# EAGLE design PlantController (EAGLE 6.2)

## Sheet 1 of 3
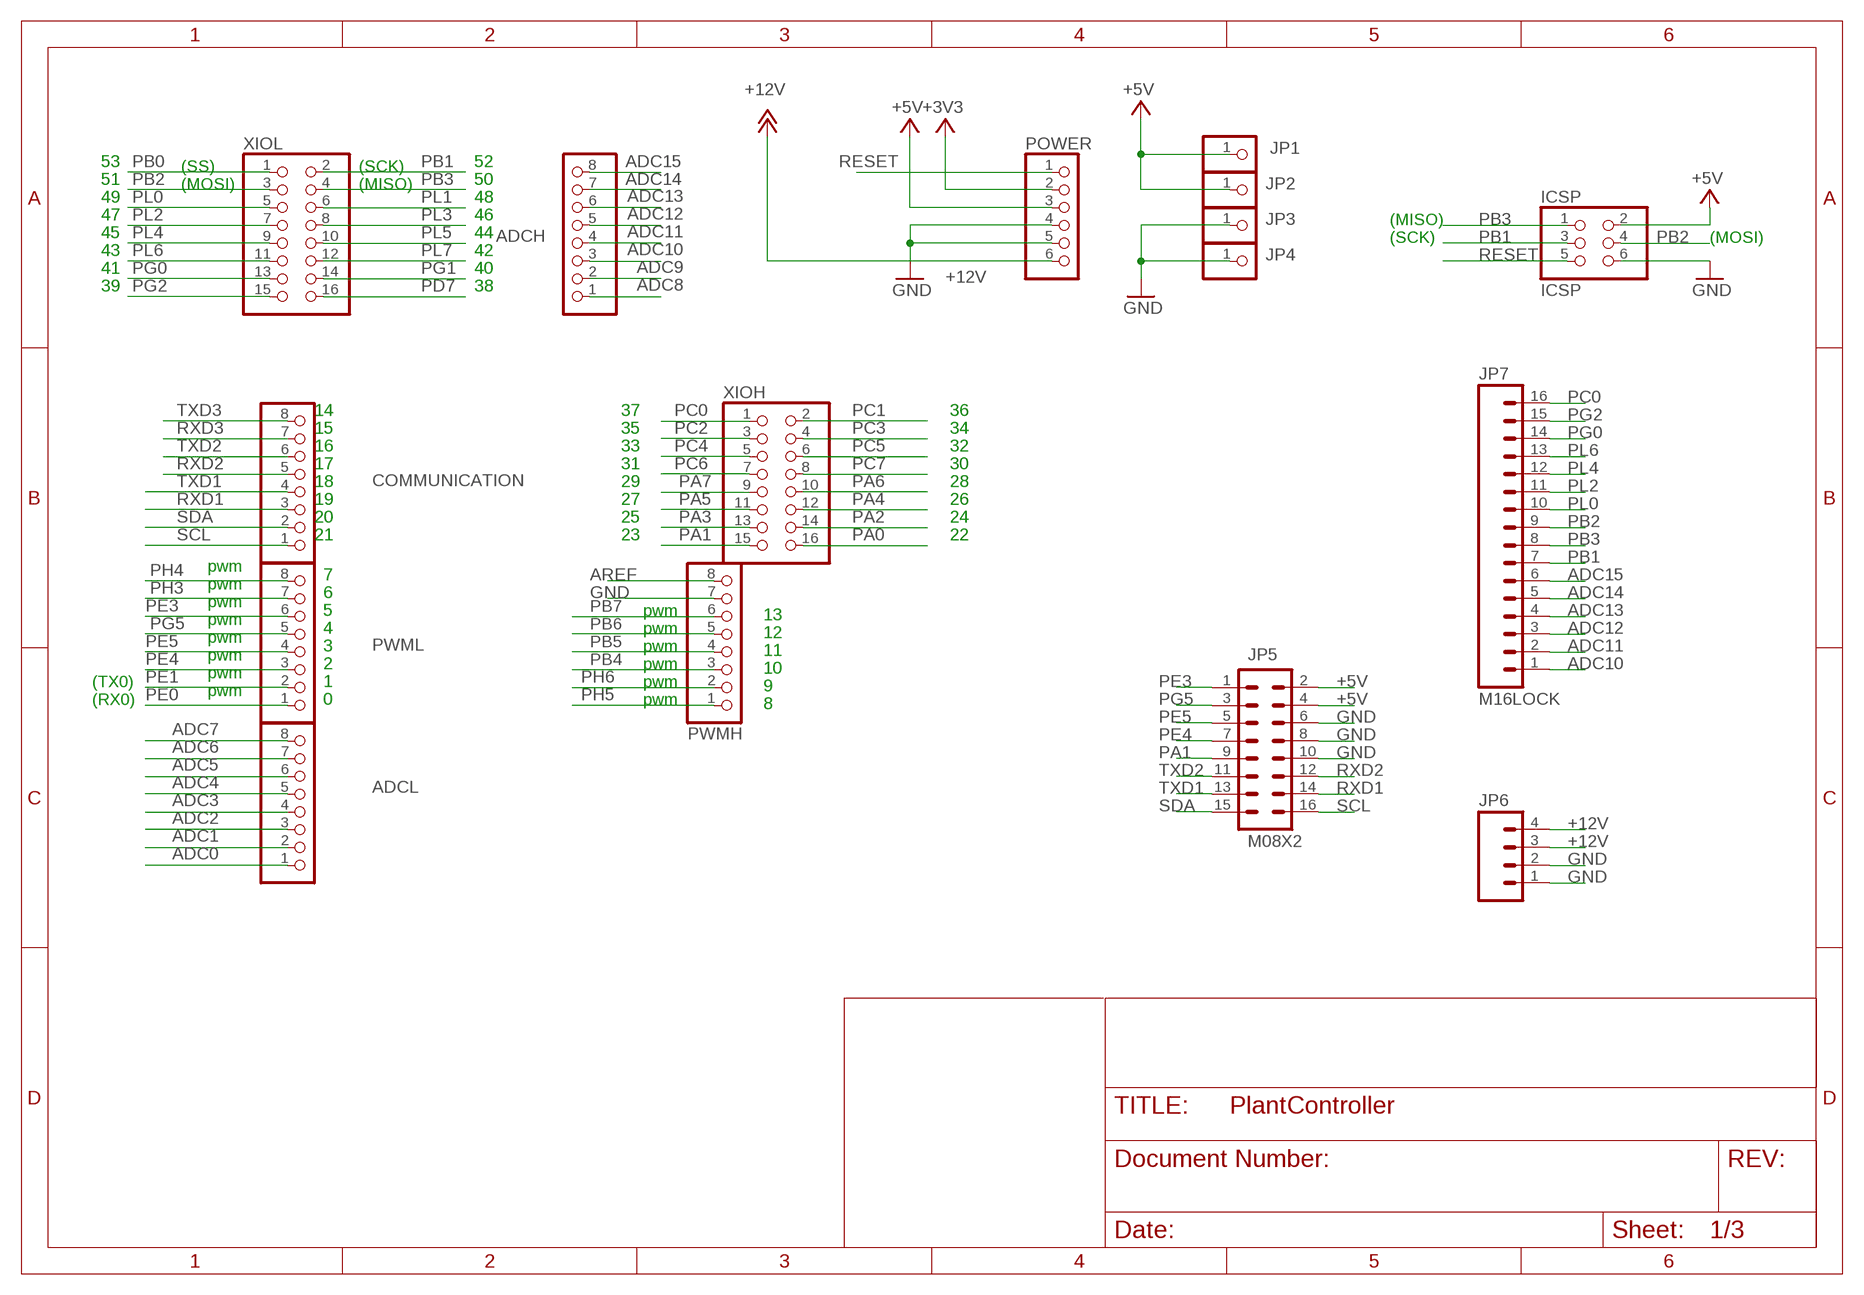
[diagram p0: schematic, sheet 1]

### Parts
ADCH  PINHD-1X8  [1X08]
ADCL  PINHD-1X8  [1X08]
COMMUNICATION  PINHD-1X8  [1X08]
ICSP  ICSP  PINHD-2X3  [2X03]
JP1  PINHD-1X1  [1X01]
JP2  PINHD-1X1  [1X01]
JP3  PINHD-1X1  [1X01]
JP4  PINHD-1X1  [1X01]
JP5  M08X2  [2X8]
JP6  M04LONGPADS  [1X04_LONGPADS]
JP7  M16LOCK  [1X16_LOCK]
POWER  PINHD-1X6  [1X06]
PWMH  PINHD-1X8  [1X08]
PWML  PINHD-1X8  [1X08]
XIOH  PINHD-2X8  [2X08]
XIOL  PINHD-2X8  [2X08]

### Nets
+3V3: POWER.2
+5V: ICSP.2 JP1.1 JP2.1 JP5.2 JP5.4 POWER.3
+12V: JP6.3 JP6.4 POWER.6 ; also sheet 2,3
ADC0: ADCL.1 ; also sheet 2
ADC1: ADCL.2 ; also sheet 2
ADC2: ADCL.3 ; also sheet 3
ADC3: ADCL.4 ; also sheet 3
ADC4: ADCL.5
ADC5: ADCL.6
ADC6: ADCL.7
ADC7: ADCL.8
ADC8: ADCH.1
ADC9: ADCH.2
ADC10: ADCH.3 JP7.1
ADC11: ADCH.4 JP7.2
ADC12: ADCH.5 JP7.3
ADC13: ADCH.6 JP7.4
ADC14: ADCH.7 JP7.5
ADC15: ADCH.8 JP7.6
AREF: PWMH.8
GND: ICSP.6 JP3.1 JP4.1 JP5.6 JP5.8 JP5.10 JP6.1 JP6.2 POWER.4 POWER.5 PWMH.7 ; also sheet 2,3
PA0: XIOH.16
PA1: JP5.9 XIOH.15
PA2: XIOH.14
PA3: XIOH.13
PA4: XIOH.12
PA5: XIOH.11
PA6: XIOH.10
PA7: XIOH.9
PB0: XIOL.1
PB1: ICSP.3 JP7.7 XIOL.2
PB2: ICSP.4 JP7.9 XIOL.3
PB3: ICSP.1 JP7.8 XIOL.4
PB4: PWMH.3
PB5: PWMH.4
PB6: PWMH.5
PB7: PWMH.6
PC0: JP7.16 XIOH.1
PC1: XIOH.2
PC2: XIOH.3
PC3: XIOH.4
PC4: XIOH.5
PC5: XIOH.6
PC6: XIOH.7
PC7: XIOH.8
PD7: XIOL.16
PE0: PWML.1
PE1: PWML.2
PE3: JP5.1 PWML.6
PE4: JP5.7 PWML.3
PE5: JP5.5 PWML.4
PG0: JP7.14 XIOL.13
PG1: XIOL.14
PG2: JP7.15 XIOL.15
PG5: JP5.3 PWML.5
PH3: PWML.7
PH4: PWML.8
PH5: PWMH.1
PH6: PWMH.2
PL0: JP7.10 XIOL.5
PL1: XIOL.6
PL2: JP7.11 XIOL.7
PL3: XIOL.8
PL4: JP7.12 XIOL.9
PL5: XIOL.10
PL6: JP7.13 XIOL.11
PL7: XIOL.12
RESET: ICSP.5 POWER.1
RXD1: COMMUNICATION.3 JP5.14
RXD2: COMMUNICATION.5 JP5.12
RXD3: COMMUNICATION.7
SCL: COMMUNICATION.1 JP5.16
SDA: COMMUNICATION.2 JP5.15
TXD1: COMMUNICATION.4 JP5.13
TXD2: COMMUNICATION.6 JP5.11
TXD3: COMMUNICATION.8

### Notes on the sheet
- 53 | (SS) | (SCK) | 52
- 51 | (MOSI) | (MISO) | 50
- 49 | 48
- 47 | 46 | (MISO)
- 45 | 44 | (SCK) | (MOSI)
- 43 | 42
- 41 | 40
- 39 | 38
- 14 | 37 | 36
- 15 | 35 | 34
- 16 | 33 | 32
- 17 | 31 | 30
- 18 | 29 | 28
- 19 | 27 | 26
- 20 | 25 | 24
- 21 | 23 | 22
- pwm
- 7
- pwm
- 6
- pwm
- 5 | pwm | 13
- pwm
- 4 | pwm | 12
- pwm
- 3 | pwm | 11
- pwm
- 2 | pwm | 10
- pwm
- (TX0) | 1 | pwm | 9
- pwm
- (RX0) | 0 | pwm | 8

## Sheet 2 of 3
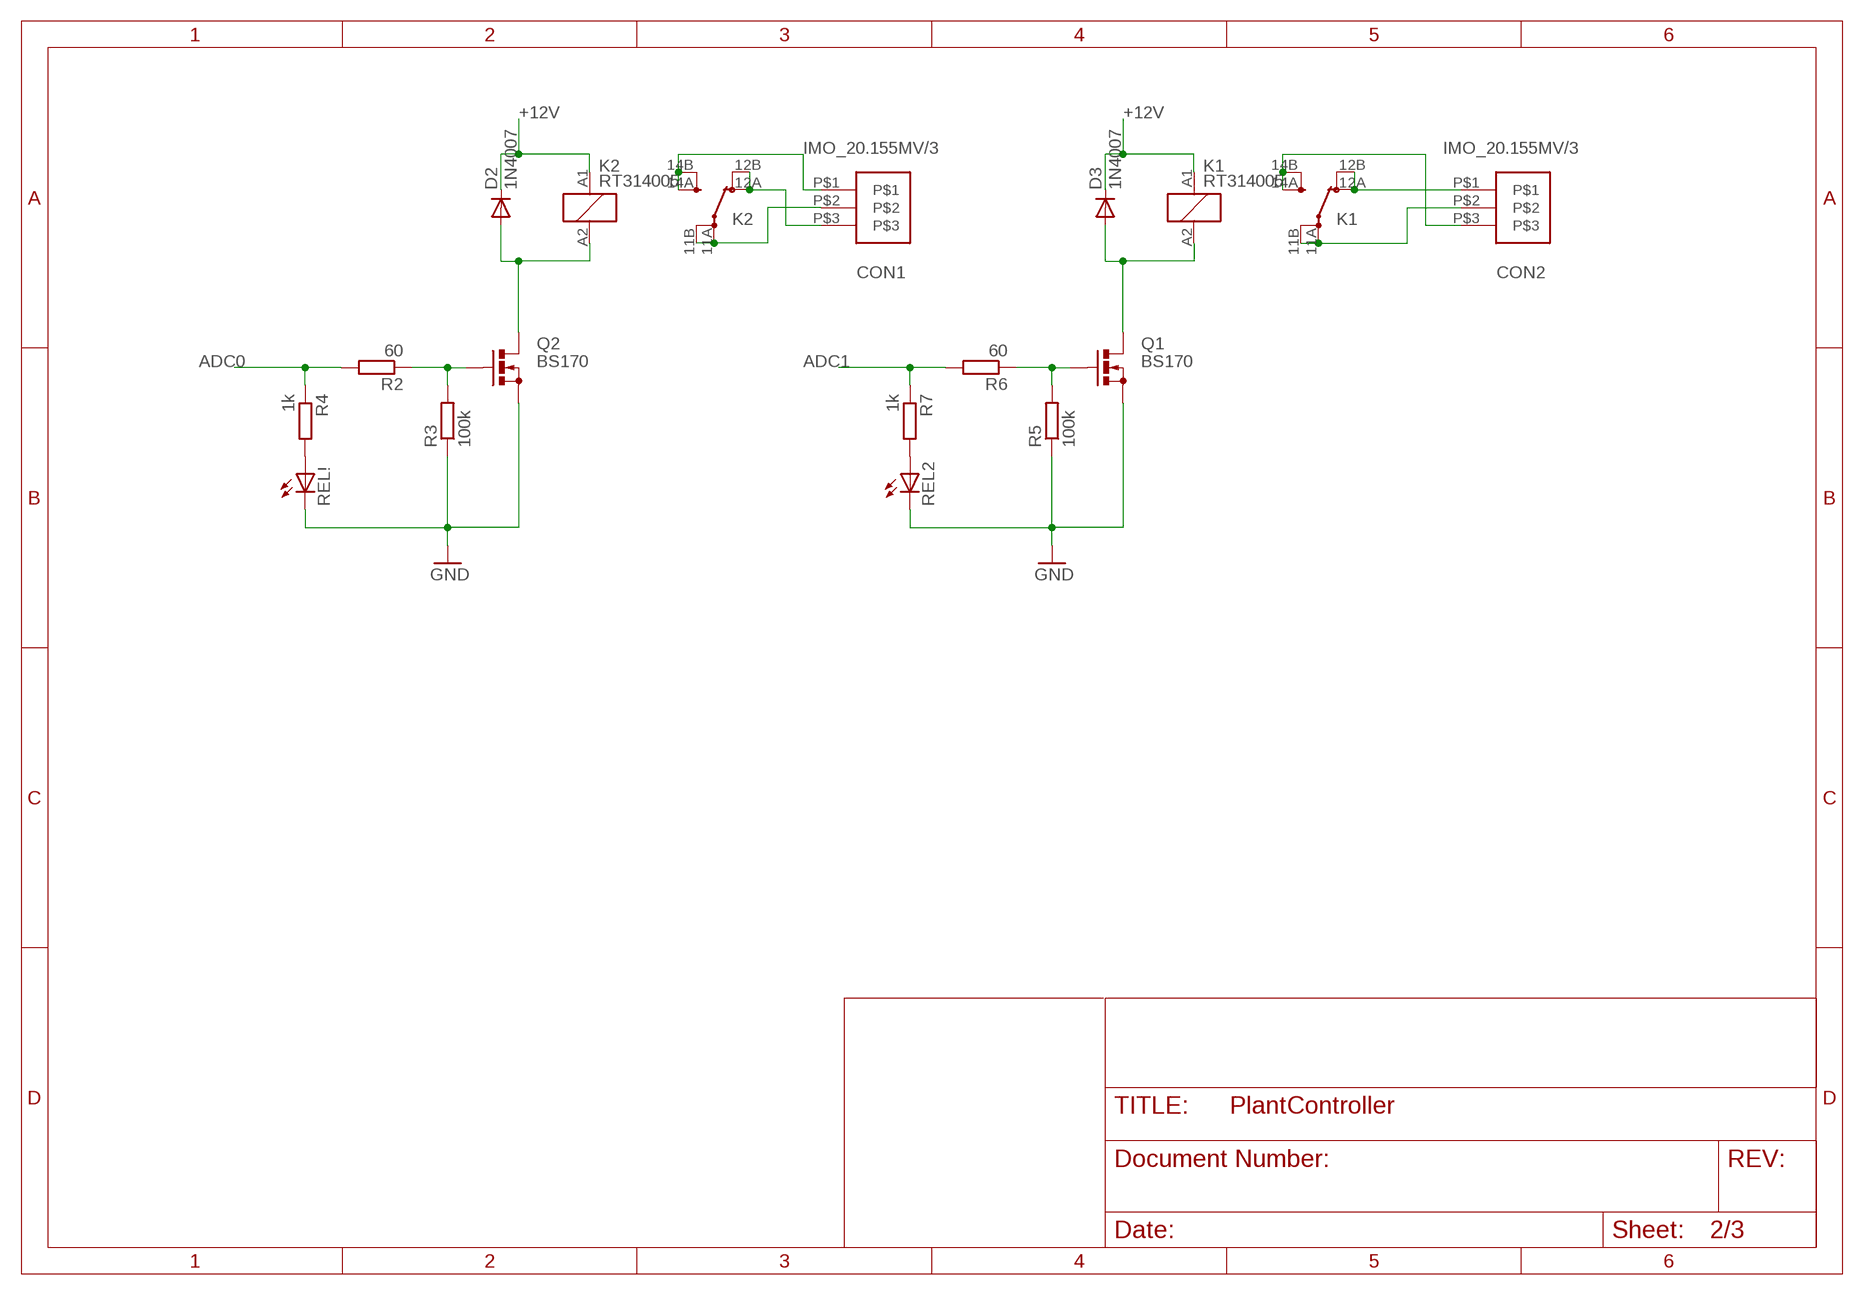
[diagram p1: schematic, sheet 2]

### Parts
CON1  IMO_20.155MV/3  [IMO_20.155MV/3]
CON2  IMO_20.155MV/3  [IMO_20.155MV/3]
D2  1N4007  1N4004  [DO41-10]
D3  1N4007  1N4004  [DO41-10]
K1  RT314005  [RT-C/O16A5]
K2  RT314005  [RT-C/O16A5]
Q1  BS170  [SOT54E]
Q2  BS170  [SOT54E]
R2  60  R-EU_R0805  [R0805]
R3  100k  R-EU_R0805  [R0805]
R4  1k  R-EU_R0805  [R0805]
R5  100k  R-EU_R0805  [R0805]
R6  60  R-EU_R0805  [R0805]
R7  1k  R-EU_R0805  [R0805]
REL2  LED5MM  [LED5MM]
REL!  LED5MM  [LED5MM]

### Nets
+12V: D2.C D3.C K1.A1 K2.A1 ; also sheet 1,3
ADC0: R2.2 R4.1 ; also sheet 1
ADC1: R6.2 R7.1 ; also sheet 1
GND: Q1.S Q2.S R3.1 R5.1 REL2.K(C) REL!.K(C) ; also sheet 1,3
N$3: D2.A K2.A2 Q2.D
N$4: Q2.G R2.1 R3.2
N$6: D3.A K1.A2 Q1.D
N$7: R4.2 REL!.A
N$8: Q1.G R5.2 R6.1
N$10: R7.2 REL2.A
N$11: CON1.P$2 K2.11A(2:PA) K2.11B(2:PB)
N$12: CON1.P$3 K2.12A(2:OA) K2.12B(2:OB)
N$13: CON1.P$1 K2.14A(2:SA) K2.14B(2:SB)
N$14: CON2.P$2 K1.11A(2:PA) K1.11B(2:PB)
N$15: CON2.P$1 K1.12A(2:OA) K1.12B(2:OB)
N$16: CON2.P$3 K1.14A(2:SA) K1.14B(2:SB)

## Sheet 3 of 3
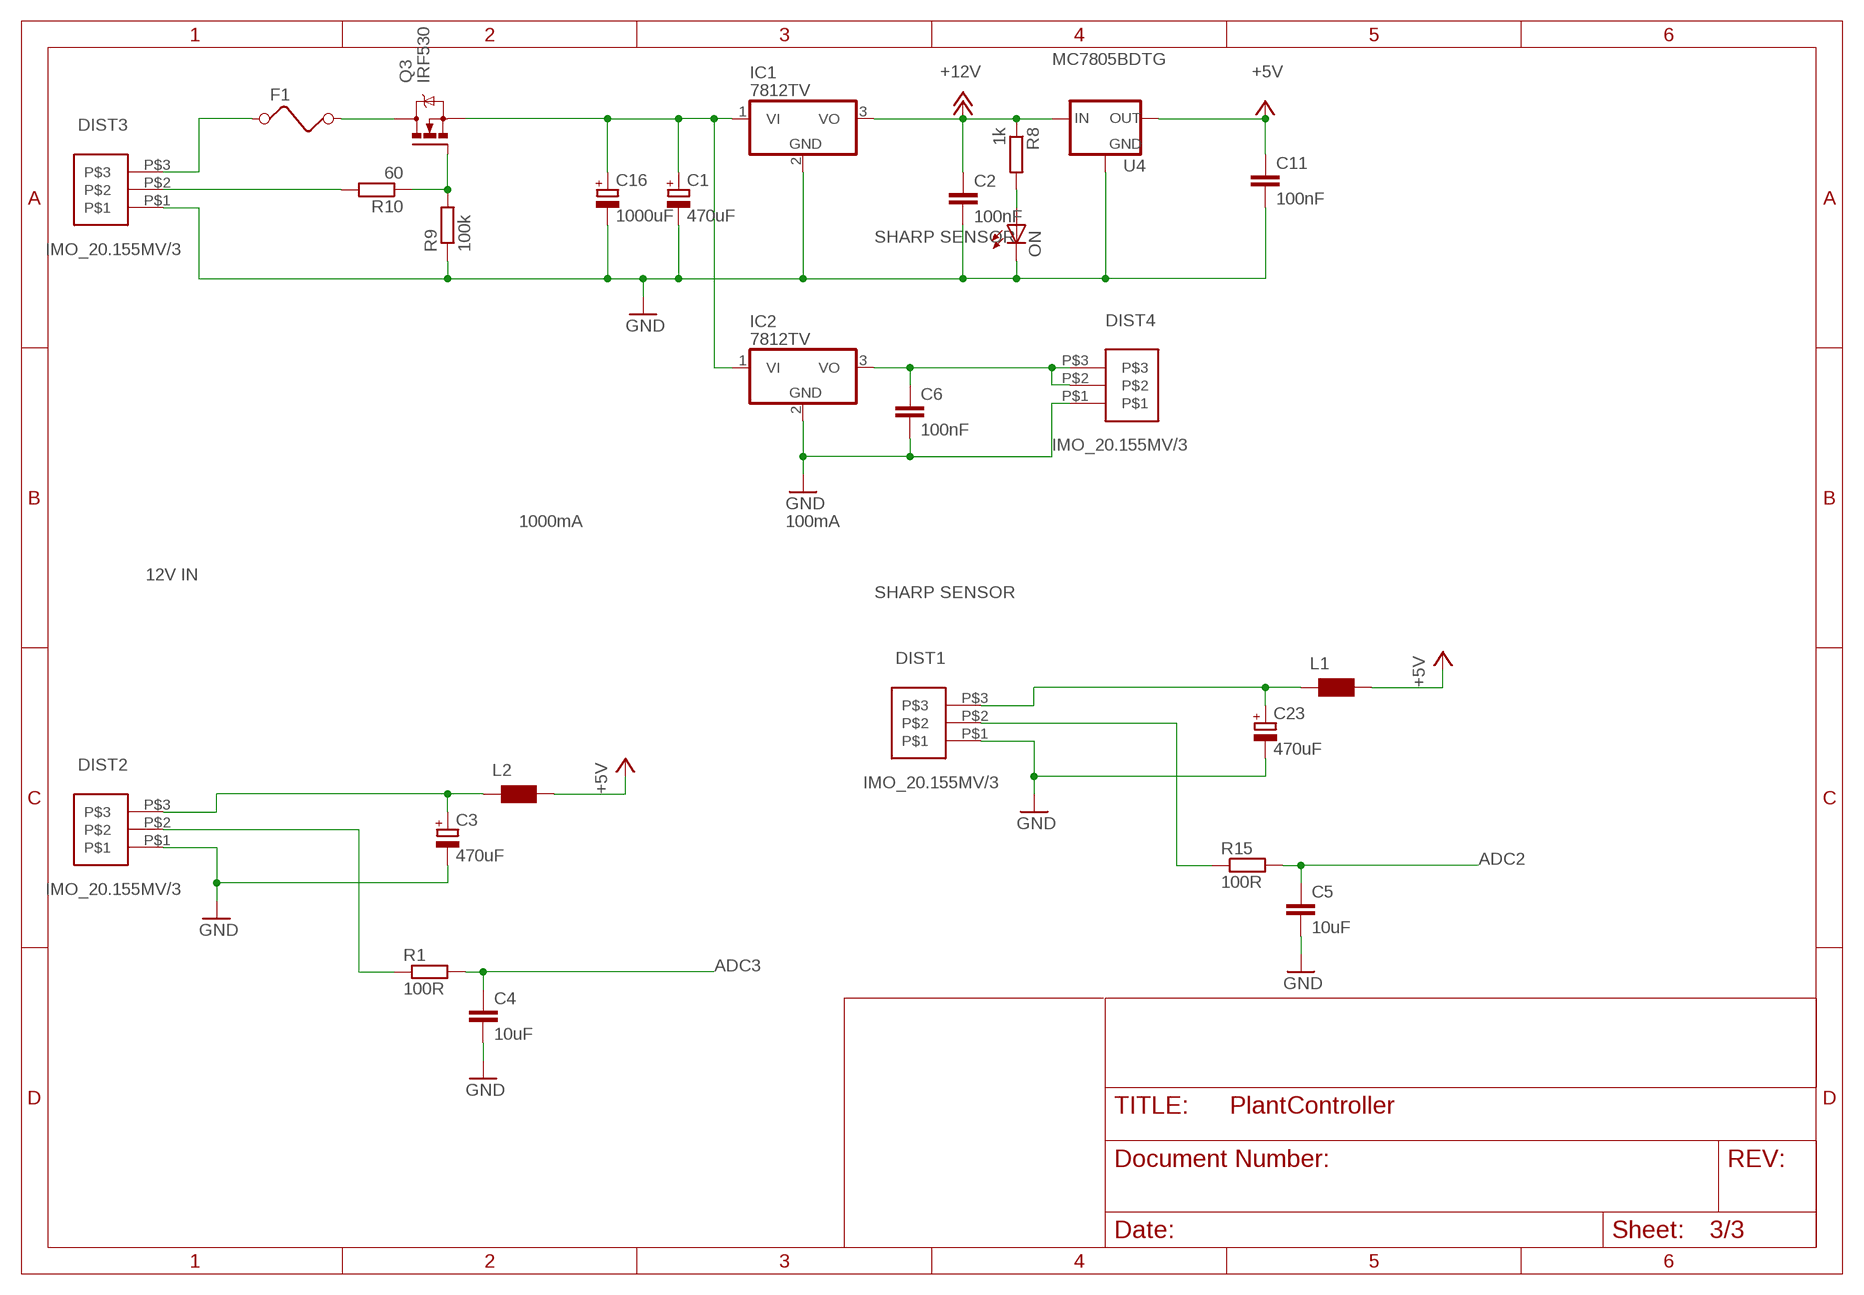
[diagram p2: schematic, sheet 3]

### Parts
C1  470uF  CPOL-EUE7.5-16  [E7,5-16]
C2  100nF  C-EUC0805K  [C0805K]
C3  470uF  CPOL-EUF  [PANASONIC_F]
C4  10uF  C-EUC0805K  [C0805K]
C5  10uF  C-EUC0805K  [C0805K]
C6  100nF  C-EUC0805K  [C0805K]
C11  100nF  C-EUC0805K  [C0805K]
C16  1000uF  CPOL-EUE7.5-16  [E7,5-16]
C23  470uF  CPOL-EUF  [PANASONIC_F]
DIST1  IMO_20.155MV/3  [IMO_20.155MV/3]
DIST2  IMO_20.155MV/3  [IMO_20.155MV/3]
DIST3  IMO_20.155MV/3  [IMO_20.155MV/3]
DIST4  IMO_20.155MV/3  [IMO_20.155MV/3]
F1  FUSE  [FUSE]
IC1  7812TV  [TO220V]
IC2  7812TV  [TO220V]
L1  WE-KI_0805_B  [WE-KI_0805_B]
L2  WE-KI_0805_B  [WE-KI_0805_B]
ON  LED5MM  [LED5MM]
Q3  IRF530  [TO220BV]
R1  100R  R-EU_R0805  [R0805@1]
R8  1k  R-EU_R0805  [R0805]
R9  100k  R-EU_R0805  [R0805]
R10  60  R-EU_R0805  [R0805]
R15  100R  R-EU_R0805  [R0805@1]
U4  MC7805BDTG  [DPAK]

### Nets
+5V_SENS: C11.1 L1.1 L2.1 U4.3(OUT) ; supply symbol labelled +5V
+12V: C2.1 IC1.3(VO) R8.1 U4.1(IN) ; also sheet 1,2
ADC2: C5.1 R15.2 ; also sheet 1
ADC3: C4.1 R1.2 ; also sheet 1
GND: C1.- C2.2 C3.- C4.2 C5.2 C6.2 C11.2 C16.- C23.- DIST1.P$1 DIST2.P$1 DIST3.P$1 DIST4.P$1 IC1.2(GND) IC2.2(GND) ON.K(C) R9.1 U4.4(GND) ; also sheet 1,2
N$1: C6.1 DIST4.P$2 DIST4.P$3 IC2.3(VO)
N$22: Q3.G R9.2 R10.1
N$23: DIST3.P$2 R10.2
N$25: ON.A R8.2
SENSOR_POWER: C23.+ DIST1.P$3 L1.2
SENSOR_POWER1: C3.+ DIST2.P$3 L2.2
SHARP_SENSOR: DIST1.P$2 R15.1
SHARP_SENSOR1: DIST2.P$2 R1.1
VIN24: C1.+ C16.+ IC1.1(VI) IC2.1(VI) Q3.S
VINFIN: DIST3.P$3 F1.1
VINFOUT: F1.2 Q3.D

### Notes on the sheet
- SHARP SENSOR
- 1000mA | 100mA
- 12V IN
- SHARP SENSOR

## Library data of the parts
ADCH ADCL COMMUNICATION PWMH PWML = pinhead:PINHD-1X8: PIN HEADER
C1 C16 = rcl:CPOL-EU: POLARIZED CAPACITOR, European symbol
C2 C4-C6 C11 = resistor:C-EU: CAPACITOR, European symbol
C3 C23 = resistor:CPOL-EU: POLARIZED CAPACITOR, European symbol
CON1 CON2 DIST1-DIST4 = CONNECTORS:IMO_20.155MV/3
D2 D3 = diode:1N4004: DIODE general purpose rectifier, 1 A
F1 = special:FUSE: FUSE 5 x 20 mm
IC1 IC2 = linear:78*: Positive VOLTAGE REGULATOR Source: http://cache.national.com/ds/LM/LM78L05.pdf http://www.fairchildsemi.com/ds/LM/LM7805.pdf
ICSP = pinhead:PINHD-2X3: PIN HEADER
JP1-JP4 = pinhead:PINHD-1X1: PIN HEADER
JP5 = SparkFun:M08X2
JP6 = SparkFun:M04: Header 4 Standard 4-pin 0.1" header. Use with straight break away headers (SKU : PRT-00116), right angle break away headers (PRT-00553), swiss pins (PRT-00743), machine pins (PRT-00117), and female headers (PRT-00115). Molex polarized connector foot print use with SKU : PRT-08231 with associated crimp pins and housings. 1MM SMD Version SKU: PRT-10208
JP7 = SparkFun:M16
K1 K2 = relay:RT31*: Power PCB Relayl SCHRACK 1 pole 12 / 16 A, DC- or AC-coi Source: http://www.schrack.com/.. 5819.pdf; MPN: RT314005; OC_FARNELL: 1629043; OC_NEWARK: 03P2418
L1 L2 = wuerth-elektronik:WE-KI: SMD Wire Wound Ceramic Inductor WE-KI - Wire wound - High thermal stability - Rated current up to 1 A - High Q-factor - High SRF -- Especially developed for high frequency applications -- Perfect for applications in telecommunications -- Bluetooth -- Wireless LAN
ON REL2 REL! = led:LED: LED OSRAM: - CHIPLED LG R971, LG N971, LY N971, LG Q971, LY Q971, LO R971, LY R971 LH N974, LH R974 LS Q976, LO Q976, LY Q976 LO Q996 - Hyper CHIPLED LW Q18S LB Q993, LB Q99A, LB R99A - SideLED LS A670, LO A670, LY A670, LG A670, LP A670 LB A673, LV A673, LT A673, LW A673 LH A674 LY A675 LS A676, LA A676, LO A676, LY A676, LW A676 LS A679, LY A679, LG A679 - Hyper Micro SIDELED® LS Y876, LA Y876, LO Y876, LY Y876 LT Y87S - SmartLED LW L88C, LW L88S LB L89C, LB L89S, LG L890 LS L89K, LO L89K, LY L89K LS L896, LA L896, LO L896, LY L896 - TOPLED LS T670, LO T670, LY T670, LG T670, LP T670 LSG T670, LSP T670, LSY T670, LOP T670, LYG T670 LG T671, LOG T671, LSG T671 LB T673, LV T673, LT T673, LW T673 LH T674 LS T676, LA T676, LO T676, LY T676, LB T676, LH T676, LSB T676, LW T676 LB T67C, LV T67C, LT T67C, LS T67K, LO T67K, LY T67K, LW E67C LS E67B, LA E67B, LO E67B, LY E67B, LB E67C, LV E67C, LT E67C LW T67C LS T679, LY T679, LG T679 LS T770, LO T770, LY T770, LG T770, LP T770 LB T773, LV T773, LT T773, LW T773 LH T774 LS E675, LA E675, LY E675, LS T675 LS T776, LA T776, LO T776, LY T776, LB T776 LHGB T686 LT T68C, LB T68C - Hyper Mini TOPLED® LB M676 - Mini TOPLED Santana® LG M470 LS M47K, LO M47K, LY M47K Source: http://www.osram.convergy.de LUXEON: - LUMILED® LXK2-PW12-R00, LXK2-PW12-S00, LXK2-PW14-U00, LXK2-PW14-V00 LXK2-PM12-R00, LXK2-PM12-S00, LXK2-PM14-U00 LXK2-PE12-Q00, LXK2-PE12-R00, LXK2-PE12-S00, LXK2-PE14-T00, LXK2-PE14-U00 LXK2-PB12-K00, LXK2-PB12-L00, LXK2-PB12-M00, LXK2-PB14-N00, LXK2-PB14-P00, LXK2-PB14-Q00 LXK2-PR12-L00, LXK2-PR12-M00, LXK2-PR14-Q00, LXK2-PR14-R00 LXK2-PD12-Q00, LXK2-PD12-R00, LXK2-PD12-S00 LXK2-PH12-R00, LXK2-PH12-S00 LXK2-PL12-P00, LXK2-PL12-Q00, LXK2-PL12-R00 Source: www.luxeon.com KINGBRIGHT: KA-3528ASYC Source: www.kingbright.com
POWER = pinhead:PINHD-1X6: PIN HEADER
Q1 Q2 = transistor-small-signal:BS170: N-CHANNEL MOS FET
Q3 = transistor-power:IRF530: HEXFET Power MOSFET
R1 R15 = resistor:R-EU_: RESISTOR, European symbol
R2-R10 = rcl:R-EU_: RESISTOR, European symbol
U4 = VOLTAGE_REGULATORS:MC7805BDTG
XIOH XIOL = pinhead:PINHD-2X8: PIN HEADER

## Board
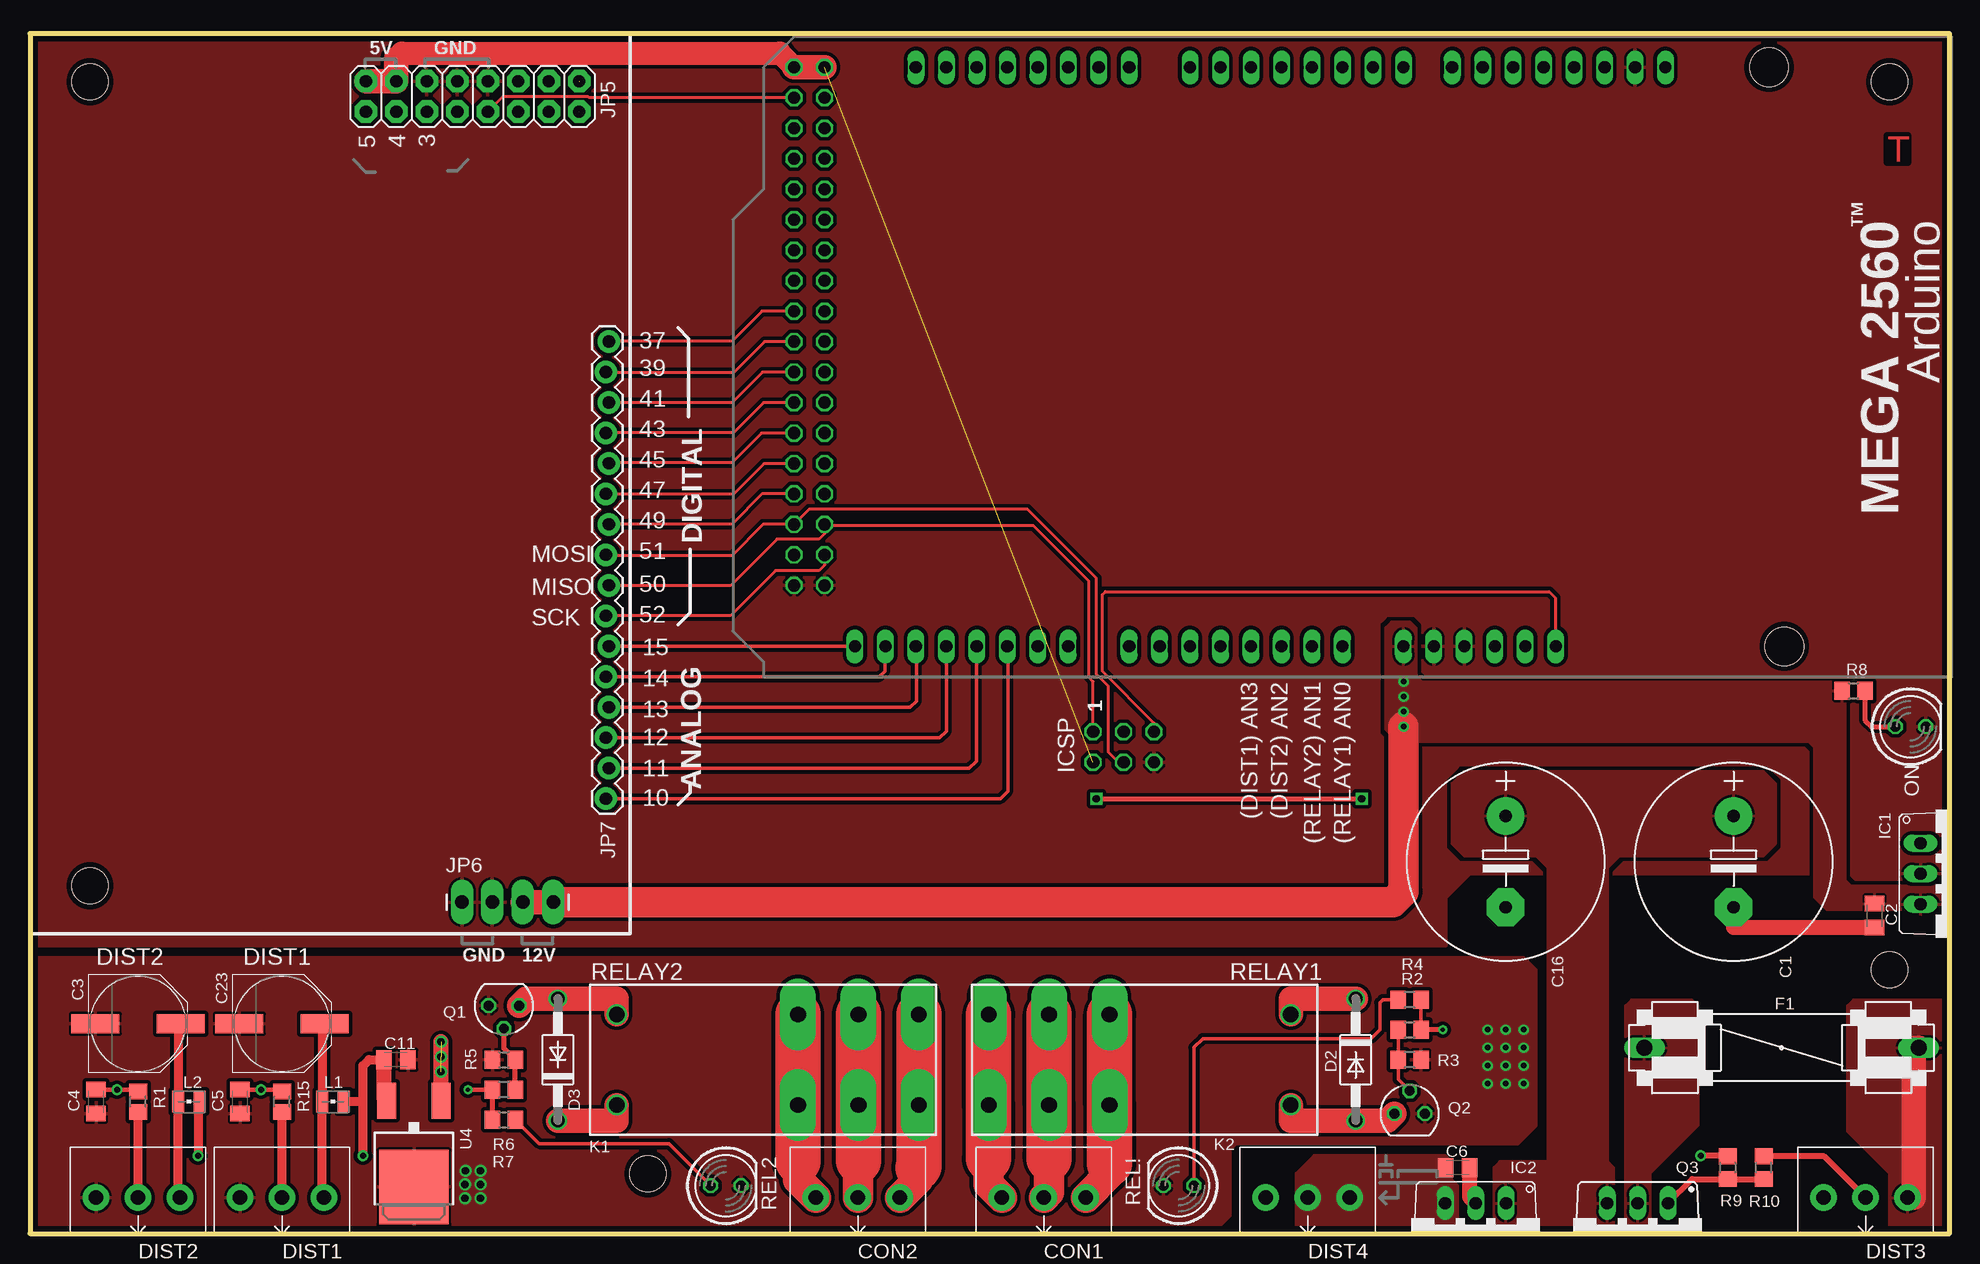
[diagram p3: board, top side]
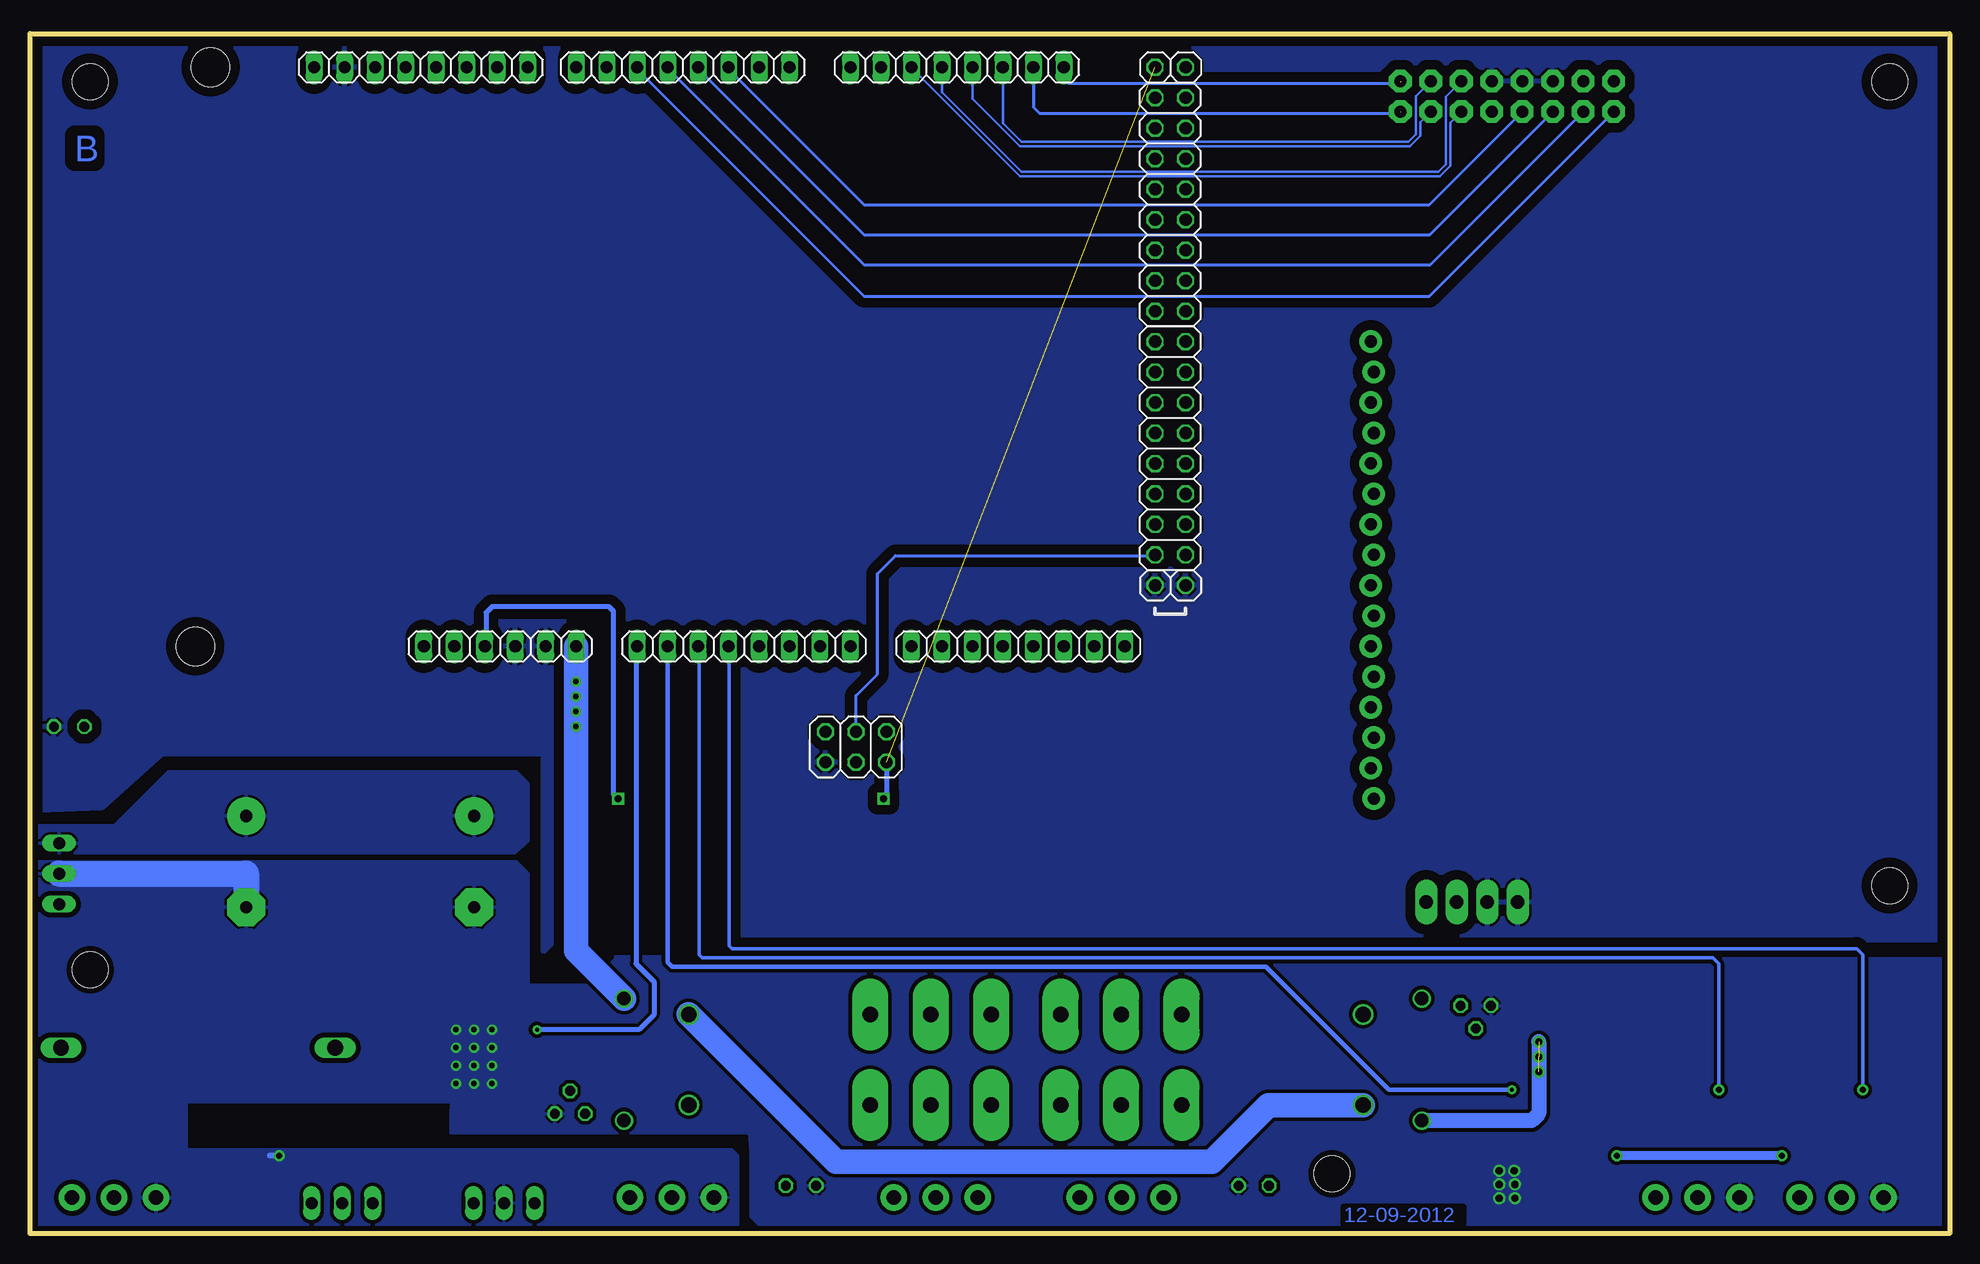
[diagram p4: board, bottom side, seen from below]

Size 160 x 100 mm. Coordinates in mm from the lower left corner, seen from the top.
Outline: 0,0 160,0 160,100 0,100 0,0
Copper layers (1*16): Top 0.018mm / dielectric 1.55mm / Bottom 0.018mm
Design rules: minimum track width 0.15mm, minimum drill 0.25mm, track to track 0.15mm, track to pad 0.15mm, pad to pad 0.15mm, via to via 0.15mm, smd to smd 0.15mm, copper to edge 0.45mm, drill to drill 0.3mm, minimum pad ring 0.2mm, minimum via ring 0.2mm, stop-mask expansion 0.1mm, vias tented up to drill 0mil, thermal gap 0.2mm
Holes 3.2 mm at 144.96,97.2 146.23,48.94
Holes 3 mm at 5,96 155,96 155,22 51.5,5 5,29

### Footprints (pad centres in the part's own frame; a part is rotated, then mirrored left to right if it is on the bottom)
1X08 = drill 1.016 long: 1 -8.89,0; 2 -6.35,0; 3 -3.81,0; 4 -1.27,0; 5 1.27,0; 6 3.81,0; 7 6.35,0; 8 8.89,0
E7,5-16 = drill 1.016 pad 3.15: + -3.81,0 | drill 1.016 pad 3.15 octagon: - 3.81,0
C0805K = smd 1.3 x 1.6: 1 -1,0; 2 1,0
PANASONIC_F = smd 4 x 1.6: + 3.55,0; - -3.55,0
IMO_20.155MV/3 = drill 1.2 pad 2.2: P$1 -3.5,0; P$2 0,0; P$3 3.5,0
DO41-10 = drill 1.118: A 5.08,0; C -5.08,0
FUSE = drill 1.321 long: 1 -11.43,0; 2 11.43,0
TO220V = drill 1.016 long: 1 -2.54,-2.54; 2 0,-2.54; 3 2.54,-2.54
2X03 = drill 1.016 octagon: 1 -2.54,-1.27; 2 -2.54,1.27; 3 0,-1.27; 4 0,1.27; 5 2.54,-1.27; 6 2.54,1.27
1X01 = drill 1.016 octagon: 1 0,0
2X8 = drill 1.016 pad 1.88 octagon: 1 0,0; 2 0,2.54; 3 2.54,0; 4 2.54,2.54; 5 5.08,0; 6 5.08,2.54; 7 7.62,0; 8 7.62,2.54; 9 10.16,0; 10 10.16,2.54; 11 12.7,0; 12 12.7,2.54; 13 15.24,0; 14 15.24,2.54; 15 17.78,0; 16 17.78,2.54
1X04_LONGPADS = drill 1.118 pad 1.88 long: 1 0,0; 2 2.54,0; 3 5.08,0; 4 7.62,0
1X16_LOCK = drill 1.016 pad 1.88: 1 0,0.127; 2 2.54,-0.127; 3 5.08,0.127; 4 7.62,-0.127; 5 10.16,0.127; 6 12.7,-0.127; 7 15.24,0.127; 8 17.78,-0.127; 9 20.32,0.127; 10 22.86,-0.127; 11 25.4,0.127; 12 27.94,-0.127; 13 30.48,0.127; 14 33.02,-0.127; 15 35.56,0.127; 16 38.1,-0.127
RT-C/O16A5 = drill 1.3 pad 3 long: 11A 7.56,3.78; 11B 7.56,-3.78; 12A 2.52,3.78; 12B 2.52,-3.78; 14A 12.6,3.78; 14B 12.6,-3.78 | drill 1.3: A1 -12.6,-3.78; A2 -12.6,3.78
WE-KI_0805_B = smd 1.02 x 1.78: 1 -0.89,0; 2 0.89,0
LED5MM = drill 0.813 octagon: A -1.27,0; K 1.27,0
1X06 = drill 1.016 long: 1 -6.35,0; 2 -3.81,0; 3 -1.27,0; 4 1.27,0; 5 3.81,0; 6 6.35,0
SOT54E = drill 0.813 octagon: D -1.27,0; G 0,1.905; S 1.27,0
TO220BV = drill 1.016 long: D 0,-2.54; G -2.54,-2.54; S 2.54,-2.54
R0805 = smd 1.3 x 1.5: 1 -0.85,0; 2 0.85,0
R0805' = smd 1.3 x 1.5: 1 -0.95,0; 2 0.95,0
DPAK = smd 1.6 x 3: 1 -2.28,-6.07; 3 2.28,-6.07 | smd 5.8 x 6.2: 4 0,1.11
2X08 = drill 1.016 octagon: 1 -8.89,-1.27; 2 -8.89,1.27; 3 -6.35,-1.27; 4 -6.35,1.27; 5 -3.81,-1.27; 6 -3.81,1.27; 7 -1.27,-1.27; 8 -1.27,1.27; 9 1.27,-1.27; 10 1.27,1.27; 11 3.81,-1.27; 12 3.81,1.27; 13 6.35,-1.27; 14 6.35,1.27; 15 8.89,-1.27; 16 8.89,1.27

### Placement (x,y rotation side)
ADCH  77.65,48.94 0 bottom
ADCL  100.51,48.94 0 bottom
C1  142,31 270 top
C2  153.75,26.5 270 top
C3  9,17.5 0 top
C4  5.5,11 270 top
C5  17.5,11 270 top
C6  119,5.5 0 top
C11  30.5,14.5 0 top
C16  123,31 270 top
C23  21,17.5 0 top
COMMUNICATION  82.73,97.2 180 bottom
CON1  84.5,3 0 top
CON2  69,3 0 top
D2  110.5,14.5 270 top
D3  44,14.5 90 top
DIST1  21,3 0 top
DIST2  9,3 0 top
DIST3  153,3 0 top
DIST4  106.5,3 0 top
F1  146,15.5 180 top
IC1  160.12,30 270 top
IC2  120.5,0 180 top
ICSP  91.16,40.55 180 bottom
JP1  66.22,97.2 0 bottom
JP2  63.68,97.2 0 bottom
JP3  66.22,54.02 0 bottom
JP4  63.68,54.02 0 bottom
JP5  28,93.5 0 top
JP6  36,27.62 0 top
JP7  48.12,36.25 90 top
K1  61.5,14.5 0 top
K2  92.5,14.5 180 top
L1  25.25,11 180 top
L2  13.25,11 180 top
ON  156.75,42.25 0 top
POWER  120.83,48.94 0 bottom
PWMH  127.43,97.2 180 bottom
PWML  105.59,97.2 180 bottom
Q1  39.5,19 180 top
Q2  115,10 0 top
Q3  134,0 180 top
R1  100R  [R0805]  9,11 90 top
R2  60  [R0805']  115,17 0 top
R3  100k  [R0805']  115,14.5 180 top
R4  1k  [R0805']  115,19.5 180 top
R5  100k  [R0805']  39.5,14.5 0 top
R6  60  [R0805']  39.5,12 180 top
R7  1k  [R0805']  39.5,9.5 0 top
R8  1k  [R0805']  152,45.25 0 top
R9  100k  [R0805']  141.5,5.5 270 top
R10  60  [R0805']  144.5,5.5 90 top
R15  100R  [R0805]  21,11 90 top
REL2  58,4 0 top
REL!  95.75,4 180 top
U4  32,5 180 top
XIOH  64.95,85.77 90 bottom
XIOL  64.95,65.45 90 bottom

### Tracks (layer width: path | path; a pad name or v marks a point on that pad's centre or on a via)
+5V  (via drill 0.6 pad 0.61)  (1 unrouted)
  Top 0: JP5.2 28.21,96.04
  Top 0.406: v88.88,36.25 v111,36.25
  Top 1.778: 30.54,97.92 31,98.38 | 62.51,98.38 JP2.1
  Top 1.93: 31,98.38 62.51,98.38
  Top 2.032: JP5.2 JP5.4 30.54,97.92 | JP2.1 JP1.1
  Bottom 0.406: ICSP.2 88.62,36.51 v88.88,36.25 | v111,36.25 111.38,36.62 111.38,51.88 111.75,52.25 121.5,52.25 122,51.75 122,49.04 POWER.3
+5V_SENS  (via drill 0.5)
  Top 0.762: 27.75,11 L1.1 | L2.1 14,10.86 v14,6.5 | v27.75,6.5 27.75,11 | 27.75,11 27.75,14 28.25,14.5 C11.1
  Top 1.27: U4.3 29.5,11.29 C11.1
  Bottom 0.762: v14,6.5 v27.75,6.5
+12V  (via drill 0.45, 0.6)  (2 unrouted)
  Top 1.27: U4.1 34.25,11.1 v34.25,16
  Top 1.422: 114.48,42.23 v114.5,42.25
  Top 2.032: D2.C 105.1,19.58 K2.A1 | D3.C 48.9,9.42 K1.A1 | JP6.4 JP6.3
  Top 2.54: 114.48,42.23 114.48,28.5 113.61,27.62 JP6.4
  Bottom 1.27: v34.25,16 34.25,10 34.83,9.42 D3.C
  Bottom 2.032: K2.A1 92.82,6 61.5,6 56.78,10.72 K1.A1 | D2.C 114.48,23.56 POWER.6
  other vias: 114.5,46 114.5,44.75 114.5,43.5 34.25,14.75 34.25,13.5
  pour Top (isolate 0.305): 161.5,26.5 158,26.5 156,27 149.75,27 148.75,28 148.75,40.5 148.25,41 114,41 113,42 113,50.5 113.5,51 115,51 115.5,50.5 115.5,46.5 116,46 150.25,46 151.25,45 151.25,29.5 151.75,29 161,29 161.5,28.5
ADC0  (via drill 0.35)
  Top 0.305: R2.2 R4.1
  Top 0.406: v117.75,17 R2.2
  Bottom 0.406: ADCL.1 109.5,48.84 109.5,22.5 108,21 108,18.25 109.25,17 v117.75,17
ADC1  (via drill 0.35)
  Top 0.381: R6.2 v36.5,12
  Top 0.406: R7.1 R6.2
  Bottom 0.381: v36.5,12 46.75,12 57,22.25 106.5,22.25 106.86,22.61 ADCL.2
ADC2  (via drill 0.5)
  Top 0.381: R15.2 20.85,12 v19.25,12 C5.1
  Bottom 0.305: ADCL.3 104.25,48.87 104.25,23.25 104,23 19.75,23 19.25,22.5 v19.25,12
ADC3  (via drill 0.5)
  Top 0.381: R1.2 8.85,12 v7.25,12 C4.1
  Bottom 0.305: ADCL.4 101.75,48.91 101.75,24 101.5,23.75 7.75,23.75 7.25,23.25 v7.25,12
ADC10
  Top 0.305: JP7.1 80.88,36.25 81.5,36.88 81.5,48.9 ADCH.3
ADC11
  Top 0.305: JP7.2 78.29,38.79 78.88,39.38 78.88,48.9 ADCH.4
ADC12
  Top 0.305: JP7.3 75.83,41.33 76.38,41.88 ADCH.5
ADC13
  Top 0.305: JP7.4 73.37,43.87 73.88,44.38 73.88,48.91 ADCH.6
ADC14
  Top 0.305: JP7.5 70.78,46.41 71.25,46.88 71.25,48.89 ADCH.7
ADC15
  Top 0.254: ADCH.8
  Top 0.305: JP7.6 ADCH.8
GND  (via drill 0.45, 0.5, 0.6)
  Top 0.508: R9.1 141.45,6.5 v139.25,6.5
  Top 1.27: C2.2 142,25.5 C1.- | IC2.2 120,3.04 C6.2
  Bottom 0.508: v139.25,6.5 140,6.5
  Bottom 2.184: IC1.2 142,30 C1.-
  other vias: 121.5,17 123,17 124.5,17 124.5,15.5 123,15.5 121.5,15.5 121.5,14 123,14 124.5,14 124.5,12.5 123,12.5 121.5,12.5 36.3,5.25 37.55,5.25 36.25,4.1 37.55,4.1 36.25,2.95 37.55,2.95
  pour Bottom (isolate 0.406): 147,-0.5 147,11 119.5,11 118.5,12 118.5,30 119.5,31 161.5,31 161.5,-0.5
  pour Bottom (isolate 0.305): 151,-1 101.5,-1 101,-0.5 101,6.5 101.5,7 147,7 151,5
  pour Top (isolate 0.305, rank 5): -0.5,23 -0.5,0 0,-0.5 98,-0.5 100,1.5 100,7 100.5,7.5 124,7.5 125.5,9 125.5,22 124.5,23
  pour Top (isolate 0.305, rank 6): 159.5,29.5 151.75,29.5 151.25,30 120,30 118,28 118,24 -2.5,24 -2.5,100 -1,101.5 163,101.5 165.5,99 165.5,33.5
  pour Bottom (isolate 0.813): 160.5,100.75 161,100.75 161,35.5 160.5,35.25 154,35.5 149,40 117.25,40 117.25,23.5 116.25,24.5 -1.5,24.5 -1.5,101.25 -0.75,100.5 160.5,100.5
  pour Bottom (isolate 0.305, rank 5): -0.6,22.9 -0.6,-0.1 -0.1,-0.6 97.9,-0.6 99.9,1.4 99.9,6.9 100.05,8.35 123.6,8.4 124.9,8.35 124.8,20.65 113.4,20.75 111.2,22.9 111.2,23.1
N$1
  pour Top (isolate 0.254, no thermals): 119,0 119,4 118.5,4.5 118.5,6 118,6.5 107,6.5 105.5,5 105.5,-0.5 118.5,-0.5
N$3
  Top 2.032: K2.A2 105.1,9.42 D2.A 113.15,9.42 Q2.D
N$4
  Top 0.305: Q2.G 114.05,12.86 R3.2 R2.1
N$6
  Top 2.032: K1.A2 48.9,19.58 D3.A 41.35,19.58 Q1.D
N$7
  Top 0.305: R4.2 112.75,19.5 112.5,19.25 112.5,17 111.75,16.25 97.75,16.25 97.02,15.52 REL!.A
N$8
  Top 0.406: R6.1 R5.2 39.5,15.45 Q1.G
N$10
  Top 0.305: R7.2 42.45,7.5 53.25,7.5 56.73,4.02 REL2.A
N$11
  Top 2.54: CON1.P$2 84.94,3.44 84.94,6.25
  Top 3.81: K2.11B K2.11A 84.94,6.78 84.94,6.25
N$12
  Top 2.54: CON1.P$3 89.99,4.99 89.99,5.82
  Top 3.81: K2.12B K2.12A 89.99,9.46 89.99,5.82
N$13
  Top 2.54: CON1.P$1 79.89,4.11 79.89,6.23
  Top 3.81: K2.14B K2.14A 79.89,6.23
N$14
  Top 0.254: 69,5.5 69.06,4.56 69.06,6.06
  Top 2.54: CON2.P$2 69,5.5
  Top 3.81: 69.06,6.06 K1.11B K1.11A
N$15
  Top 2.54: CON2.P$1 64,4.5 64.02,6.02
  Top 3.81: 64.02,6.02 K1.12B K1.12A
N$16
  Top 2.54: CON2.P$3 74,4.5 74,5.5
  Top 3.81: 74,5.5 74.1,5.6 K1.14B K1.14A
N$22
  Top 0.508: Q3.G 138.55,4.55 R9.2 R10.1
N$23
  Top 0.508: DIST3.P$2 149.55,6.45 R10.2
N$25
  Top 0.406: R8.2 152.95,42.8 153.5,42.25 ON.A
PA1
  Top 0.254: XIOH.15 46.59,94.66 46.5,94.75 39.41,94.75 JP5.9
PB1
  Top 0.254: XIOL.2 66.22,55.72 65.75,55.25 62.12,55.25 58.38,51.5 JP7.7
  Bottom 0.254: ICSP.3 91.16,44.84 89.38,46.62 89.38,55 87.88,56.5 66.28,56.5 XIOL.2
PB2
  Top 0.254: JP7.9 48.07,56.5 58.5,56.5 61.1,59.1 XIOL.3 64.95,60.38 83.12,60.38 88.88,54.62 88.88,46.62 89.88,45.62 89.88,40.12 90.72,39.28 ICSP.4
PB3
  Top 0.254: JP7.8 48.28,54 58.38,54 62.25,57.88 65.75,57.88 66.22,58.34 XIOL.4 66.32,59 83.62,59 88.25,54.38 88.25,46.38 88.62,46.01 ICSP.1
PC0
  Top 0.254: XIOH.1 61.01,76.88 58.5,74.38 48.28,74.38 JP7.16
PE3
  Bottom 0.254: PWML.6 109.4,97.03 90.5,78.12 43.38,78.12 JP5.1
PE4
  Bottom 0.254: PWML.3 101.83,97.08 90.5,85.75 43.37,85.75 JP5.7
PE5
  Bottom 0.254: PWML.4 104.32,97.07 90.5,83.25 43.33,83.25 JP5.5
PG0
  Top 0.254: XIOL.13 61.05,71.8 58.5,69.25 48.27,69.25 JP7.14
PG2
  Top 0.254: XIOL.15 61.22,74.34 58.62,71.75 48.06,71.75 JP7.15
PG5
  Bottom 0.254: PWML.5 106.86,97.11 90.5,80.75 43.29,80.75 JP5.3
PL0
  Top 0.254: XIOL.5 61.02,61.64 58.5,59.12 48.27,59.12 JP7.10
PL2
  Top 0.254: XIOL.7 61.18,64.18 58.62,61.62 48.02,61.62 JP7.11
PL4
  Top 0.254: XIOL.9 60.97,66.72 58.5,64.25 48.31,64.25 JP7.12
PL6
  Top 0.254: XIOL.11 61.13,69.26 58.62,66.75 48.02,66.75 JP7.13
RESET
  Top 0.254: ICSP.5 93.7,42.55 89.38,46.88 89.38,53.25 89.62,53.5 126.62,53.5 127.12,53 127.12,48.99 POWER.1
RXD1
  Bottom 0.203: COMMUNICATION.3 78.92,92.55 77.38,91 45.12,91 44.5,91.62 44.5,94.78 JP5.14
RXD2
  Bottom 0.203: COMMUNICATION.5 84,95.12 77.38,88.5 42.62,88.5 42,89.12 42,94.74 JP5.12
SCL  (1 unrouted)
  Bottom 0.254: COMMUNICATION.1 73.84,96.22 73.5,95.88 45.88,95.88 45.75,96
SDA  (1 unrouted)
  Bottom 0.254: COMMUNICATION.2 76.38,93.88 75.88,93.38 45.88,93.38 45.75,93.5
SENSOR_POWER
  Top 0.762: C23.+ 24.36,17.31 L1.2 24.36,3.14 DIST1.P$3
SENSOR_POWER1
  Top 0.762: DIST2.P$3 12.36,3.14 L2.2 12.36,17.31 C3.+
SHARP_SENSOR
  Top 0.762: DIST1.P$2 R15.1
SHARP_SENSOR1
  Top 0.762: DIST2.P$2 R1.1
TXD1
  Bottom 0.203: COMMUNICATION.4 81.46,94.58 77.5,90.62 45,90.62 44.12,91.5 44.12,92.61 JP5.13
TXD2
  Bottom 0.203: COMMUNICATION.6 86.54,97.17 77.5,88.12 42.5,88.12 41.62,89 41.62,92.58 JP5.11
VIN24
  pour Top: 144.5,31.5 145.5,32.5 145.5,37.5 144.5,38.5 119.5,38.5 118.5,37.5 118.5,32.5 119.5,31.5 125.5,31.5 126.5,30.5 126.5,2 127.5,1 131.5,1 132,1.5 132,5.5 131.5,6 131.5,30.5 132.5,31.5
  pour Bottom (isolate 0.406): 119.5,38.5 118.5,37.5 118.5,32.75 119.62,31.75 160.12,31.75 160.5,32 160.5,34 153,34 148.5,38.5
  pour Top (isolate 0.305): 122,4 122,1 123,0 132,0 132,5.5 131.5,6 122.5,6 122,5.5
VINFIN
  Top 2.032: DIST3.P$3 157,3 157,15.5 F1.1
  pour Top: 160.5,0 155,0 155,5 151.5,8.5 151.5,19 152,19.5 160.5,19.5 161,19 161,0.5
VINFOUT
  pour Top: 133,0.5 133,19 133.5,19.5 138.5,19.5 139,19 139,9 135,5 135,0.5 134.5,0 133.5,0

### Text on the board
Top: T
Bottom: B | 12-09-2012
tPlace: 4 | 3 | 5 | TM | 37 | 39 | 41 | 43 | 45 | 47 | 49 | MOSI | 51 | MISO | 50 | SCK | 52 | 15 | 14 | (DIST1) AN3 | (DIST2) AN2 | (RELAY2) AN1 | (RELAY1) AN0 | 13 | 12 | 11 | 10 | DIST2 | DIST1 | RELAY2 | RELAY1
tNames: 5V | GND | MEGA 2560 | Arduino | DIGITAL | ANALOG | 1 | GND | 12V
tDocu: 2 | 23 | PWM | TX2|RX2 | TX1|RX1 | SDA|SCL | Jurema Actionplant II | Plant Controller v2.0 | http://www.simbits.nl | - | 24V | + | Trig | GND | OUT | VCC | GND | OUT | VCC | 12V